# Altium schematic sheet Sheet2.SchDoc
size B
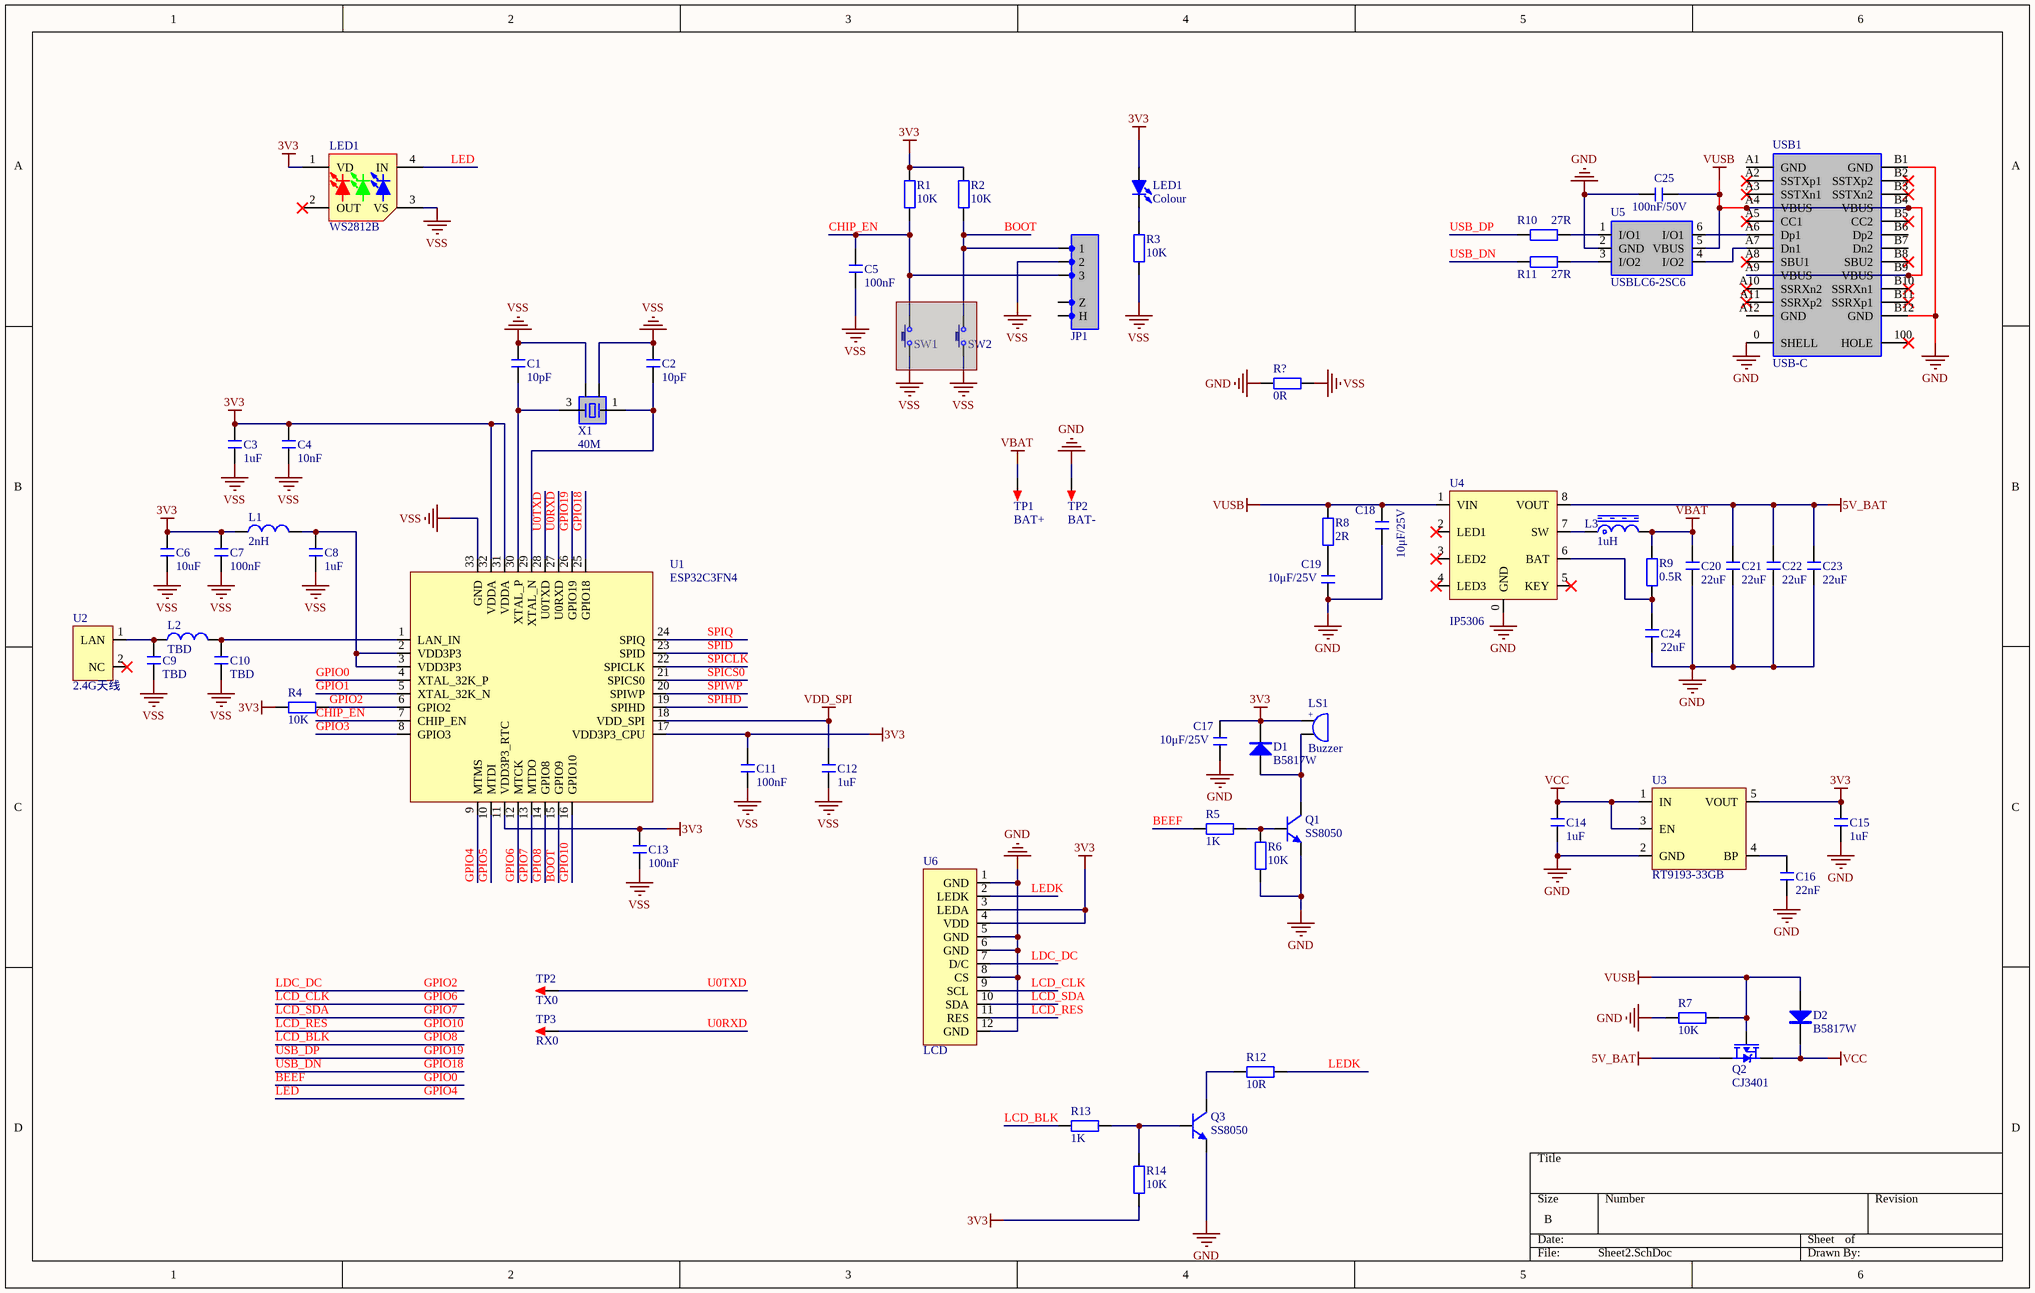
[diagram p0: Sheet2.SchDoc]

## Parts
(Parts that share a designator on the sheet are numbered #1, #2 ... from top to bottom, then left to right.)
C1  10pF  [C 0402_L]
C2  10pF  [C 0402_L]
C3  1uF  [C 0402_L]
C4  10nF  [C 0402_L]
C5  100nF  [C 0402_L]
C6  10uF  [C 0603_L]
C7  100nF  [C 0402_L]
C8  1uF  [C 0402_L]
C9  TBD  [C 0402_L]
C10  TBD  [C 0402_L]
C11  100nF  [C 0402_L]
C12  1uF  [C 0402_L]
C13  100nF  [C 0402_L]
C14  1uF  [C 0603_L]
C15  1uF  [C 0603_L]
C16  22nF  [C 0402_L]
C17  10μF/25V  [C 0603_L]
C18  10μF/25V  [C 0603_L]
C19  10μF/25V  [C 0603_L]
C20  22uF  [C 0805_L]
C21  22uF  [C 0805_L]
C22  22uF  [C 0805_L]
C23  22uF  [C 0805_L]
C24  22uF  [C 0805_L]
C25  100nF/50V  [C 0402_L]
D1  B5817W  [SOD-123]
D2  B5817W  [SOD-123]
JP1  HDR-1X3  [HDR2.54-LI-3P]  (value not drawn)
L1  2nH  [L 0603]
L2  TBD  [L 0603]
L3  1uH  [CKST0402]
LED1#1  WS2812B  [LED 3528-RGB]
LED1#2  Colour  [LED 0603R]
LS1  Buzzer  [BUZZER_5020A_S]
Q1  SS8050  [SOT23-3L]
Q2  CJ3401  [SOT23-3N]
Q3  SS8050  [SOT23-3L]
R1  10K  [R 0402_L]
R2  10K  [R 0402_L]
R3  10K  [R 0402_L]
R4  10K  [R 0402_L]
R5  1K  [R 0402_L]
R6  10K  [R 0402_L]
R7  10K  [R 0402_L]
R8  2R  [R 0603_L]
R9  0.5R  [R 0603_L]
R10  27R  [R 0402_L]
R11  27R  [R 0402_L]
R12  10R  [R 0402_L]
R13  1K  [R 0402_L]
R14  10K  [R 0402_L]
R?  0R  [R 0402_L]
SW1  3x4x2  [TSW SMD-3*4*2]  (value not drawn)  (masked out: inside a compile mask, not in the netlist)
SW2  3x4x2  [TSW SMD-3*4*2]  (value not drawn)  (masked out: inside a compile mask, not in the netlist)
TP1  BAT+  [TEST 1.6]
TP2#1  BAT-  [TEST 1.6]
TP2#2  TX0  [TEST 1.6]
TP3  RX0  [TEST 1.6]
U1  ESP32C3FN4  [QFN32 5x5_N]
U2  2.4G天线  [贴片天线]
U3  RT9193-33GB  [SOT23-5]
U4  IP5306  [ESOP8_N]
U5  USBLC6-2SC6  [SOT23-6L]
U6  LCD  [LCD]
USB1  USB-C  [USB-C/S_B]
X1  40M  [OSC 2025-4P]

## Nets
3V3: C3.1 C4.1 C6.1 C7.1 C11.1 C13.1 C15.1 C17.1 D1.2(K) L1.1 LED1#1.1(VD) LED1#2.1(A) LS1.1 R1.1 R2.2 R4.1 R14.1 U1.11(VDD3P3_RTC) U1.17(VDD3P3_CPU) U1.31(VDDA) U1.32(VDDA) U3.5(VOUT) U6.3(LEDA) U6.4(VDD)
5V_BAT: C21.1 C22.1 C23.1 Q2.3(D) U4.8(VOUT)
GND: C14.2 C15.2 C16.2 C17.2 C18.2 C19.2 C20.2 C21.2 C22.2 C23.2 C24.2 C25.2 Q1.2(E) Q3.2(E) R6.2 R7.2 R?.2 TP2#1.1 U3.2(GND) U4.0(GND) U5.2(GND) U6.1(GND) U6.5(GND) U6.6(GND) U6.8(CS) U6.12(GND) USB1.0(SHELL) USB1.B1(GND) USB1.B12(GND)
VBAT: C20.1 L3.2 R9.2 TP1.1
VCC: C14.1 D2.2(K) Q2.2(S) U3.1(IN) U3.3(EN)
VDD_SPI: C12.1 U1.18(VDD_SPI)
VSS: C1.1 C2.1 C3.2 C4.2 C5.2 C6.2 C7.2 C8.2 C9.2 C10.2 C11.2 C12.2 C13.2 JP1.2 LED1#1.3(VS) R3.1 R?.1 U1.33(GND) X1.2 X1.4
VUSB: C18.1 C25.1 D2.1(A) Q2.1(G) R7.1 R8.2 U4.1(VIN) U5.5(VBUS) USB1.A4(VBUS) USB1.A9(VBUS) USB1.B4(VBUS) USB1.B9(VBUS)
BEEF: R5.1 U1.4(XTAL_32K_P)  [also labelled GPIO0]
BOOT: JP1.1 R2.1 U1.15(GPIO9)
CHIP_EN: C5.1 JP1.3 R1.2 U1.7(CHIP_EN)
GPIO1: U1.5(XTAL_32K_N)
GPIO2: R4.2 U1.6(GPIO2) U6.7(D/C)  [also labelled LDC_DC]
GPIO3: U1.8(GPIO3)
GPIO4: LED1#1.4(IN) U1.9(MTMS)  [also labelled LED]
GPIO5: U1.10(MTDI)
GPIO6: U1.12(MTCK) U6.9(SCL)  [also labelled LCD_CLK]
GPIO7: U1.13(MTDO) U6.10(SDA)  [also labelled LCD_SDA]
GPIO8: R13.1 U1.14(GPIO8)  [also labelled LCD_BLK]
GPIO10: U1.16(GPIO10) U6.11(RES)  [also labelled LCD_RES]
GPIO18: R11.1 U1.25(GPIO18)  [also labelled USB_DN]
GPIO19: R10.1 U1.26(GPIO19)  [also labelled USB_DP]
LEDK: R12.2 U6.2(LEDK)
SPICLK: U1.22(SPICLK)
SPICS0: U1.21(SPICS0)
SPID: U1.23(SPID)
SPIHD: U1.19(SPIHD)
SPIQ: U1.24(SPIQ)
SPIWP: U1.20(SPIWP)
U0RXD: TP3.1 U1.27(U0RXD)
U0TXD: TP2#2.1 U1.28(U0TXD)
NetC1_2: C1.2 U1.30(XTAL_P) X1.3
NetC2_2: C2.2 U1.29(XTAL_N) X1.1
NetC8_1: C8.1 L1.2 U1.2(VDD3P3) U1.3(VDD3P3)
NetC9_1: C9.1 L2.1 U2.1(LAN)
NetC10_1: C10.1 L2.2 U1.1(LAN_IN)
NetC16_1: C16.1 U3.4(BP)
NetC19_1: C19.1 R8.1
NetC24_1: C24.1 R9.1 U4.6(BAT)
NetD1_1: D1.1(A) LS1.2 Q1.3(C)
NetL3_1: L3.1 U4.7(SW)
NetLED1#2_2: LED1#2.2(K) R3.2
NetQ1_1: Q1.1(B) R5.2 R6.1
NetQ3_1: Q3.1(B) R13.2 R14.2
NetQ3_3: Q3.3(C) R12.1
NetR10_2: R10.2 U5.1(I/O1)
NetR11_2: R11.2 U5.3(I/O2)
NetU5_4: U5.4(I/O2) USB1.A7(Dn1)
NetU5_6: U5.6(I/O1) USB1.A6(Dp1)

Not connected (* = marked no-connect by the designer): JP1 0(Z) 100(H); LED1#1 2(OUT)*; U2 2(NC)*; U4 2(LED1)* 3(LED2)* 4(LED3)* 5(KEY)*; USB1 100(HOLE)* A1(GND) A2(SSTXp1)* A3(SSTXn1)* A5(CC1)* A8(SBU1)* A10(SSRXn2)* A11(SSRXp2)* A12(GND) B2(SSTXp2)* B3(SSTXn2)* B5(CC2)* B6(Dp2) B7(Dn2) B8(SBU2)* B10(SSRXn1)* B11(SSRXp1)*

## Notes on the sheet
- (in symbol Buzzer) +

## Library data of the parts
C1-C25 = C: 无极性贴片电容; 版权归属: 源创客; BOM名称: 无极性贴片电容; 学习资源: www.ooocke.com
D1 D2 = 1N4007: 整流二极管; 版权归属: 源创客; BOM名称: 整流二极管; 学习资源: www.ooocke.com
JP1 = Header 3: 3P接插件; 版权归属: 源创客; BOM名称: 3P接插件; 学习资源: www.ooocke.com
L1 L2 = L: 小功率贴片电感; 版权归属: 源创客; BOM名称: 小功率贴片电感; 学习资源: www.ooocke.com
L3 = L-HP: 一体成型电感; BOM名称: 功率屏蔽电感; 版权归属: 源创客; 学习资源: www.ooocke.com
LED1#1 = SK6812: 全彩可控LED; pin to pad: 1>2 2>1 3>4 4>3
LED1#2 = LED-SMD: 贴片LED; 版权归属: 源创客; BOM名称: 贴片LED; 学习资源: www.ooocke.com
LS1 = Buzzer: 蜂鸣器; 版权归属: 源创客; BOM名称: 蜂鸣器; 学习资源: www.ooocke.com
Q1 Q3 = 8050-SMD: 高频放大-NPN型; 版权归属: 源创客; 属性: 40V 1.5A 1W 100MHZ; BOM名称: 高频放大-NPN型; 学习资源: www.ooocke.com
Q2 = PMOS_SS: 贴片信号P沟道场效应管; 版权归属: 源创客; BOM名称: P沟道场效应管; 学习资源: www.ooocke.com
R1-R14 R? = R: 贴片电阻; 版权归属: 源创客; BOM名称: 贴片电阻; 学习资源: www.ooocke.com
SW1 SW2 = TSW SMD-3x4: 3x4轻触开关; BOM名称: 3x6轻触开关; 版权归属: 源创客; 学习资源: www.ooocke.com
TP1 TP2#1 TP2#2 TP3 = TEST: 测试点; 版权归属: 源创客; BOM名称: 测试点; 学习资源: www.ooocke.com
U4 = IP5306: 锂电池充放电芯片
U5 = USBLC6-2SC6: USBESD保护器TVS陈列; 版权归属: 源创客; 学习资源: www.ooocke.com
U6 = LCD: 1.28LCD
USB1 = USB-C/S: USB-C型母接口; 版权归属: 源创客; BOM名称: USB-C型母接口; 学习资源: www.ooocke.com
X1 = XTAL-4P: 4脚无源晶振; 版权归属: 源创客; BOM名称: 4脚无源晶振; 学习资源: www.ooocke.com